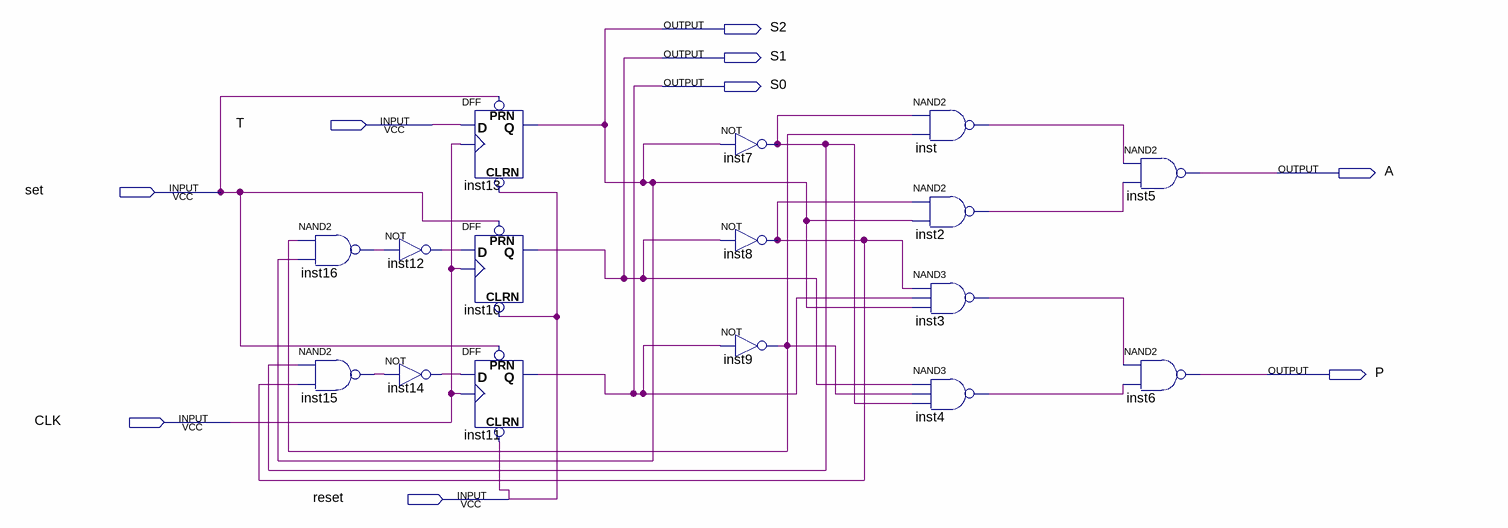
[diagram p0: schematic sheet]
// Quartus schematic lab6.bdf as structural Verilog: 16 symbols, 9 pins
module lab6 (
  input  T,
  input  set,
  input  CLK,
  input  reset,
  output S2,
  output S1,
  output S0,
  output A,
  output P
);

  wire inst2_out, inst3_out, inst4_out, inst7_out, inst8_out, inst9_out, inst12_out, inst14_out, inst15_out,
       inst16_out, inst_out;

  nand inst16 (inst16_out, inst9_out, S2);
  nand inst15 (inst15_out, inst7_out, inst8_out);
  not inst12 (inst12_out, inst16_out);
  not inst14 (inst14_out, inst15_out);
  DFF inst13 (.CLRN(reset), .CLK(CLK), .D(T), .PRN(set), .Q(S2));
  DFF inst10 (.CLRN(reset), .CLK(CLK), .D(inst12_out), .PRN(set), .Q(S1));
  DFF inst11 (.CLRN(reset), .CLK(CLK), .D(inst14_out), .PRN(set), .Q(S0));
  not inst7 (inst7_out, S2);
  not inst8 (inst8_out, S1);
  not inst9 (inst9_out, S0);
  nand inst (inst_out, inst7_out, inst9_out);
  nand inst2 (inst2_out, inst8_out, S2);
  nand inst3 (inst3_out, inst8_out, S0, S2);
  nand inst4 (inst4_out, S1, inst9_out, inst7_out);
  nand inst5 (A, inst_out, inst2_out);
  nand inst6 (P, inst3_out, inst4_out);
endmodule
